# Altium project -CWT-check_thread.PrjPcb
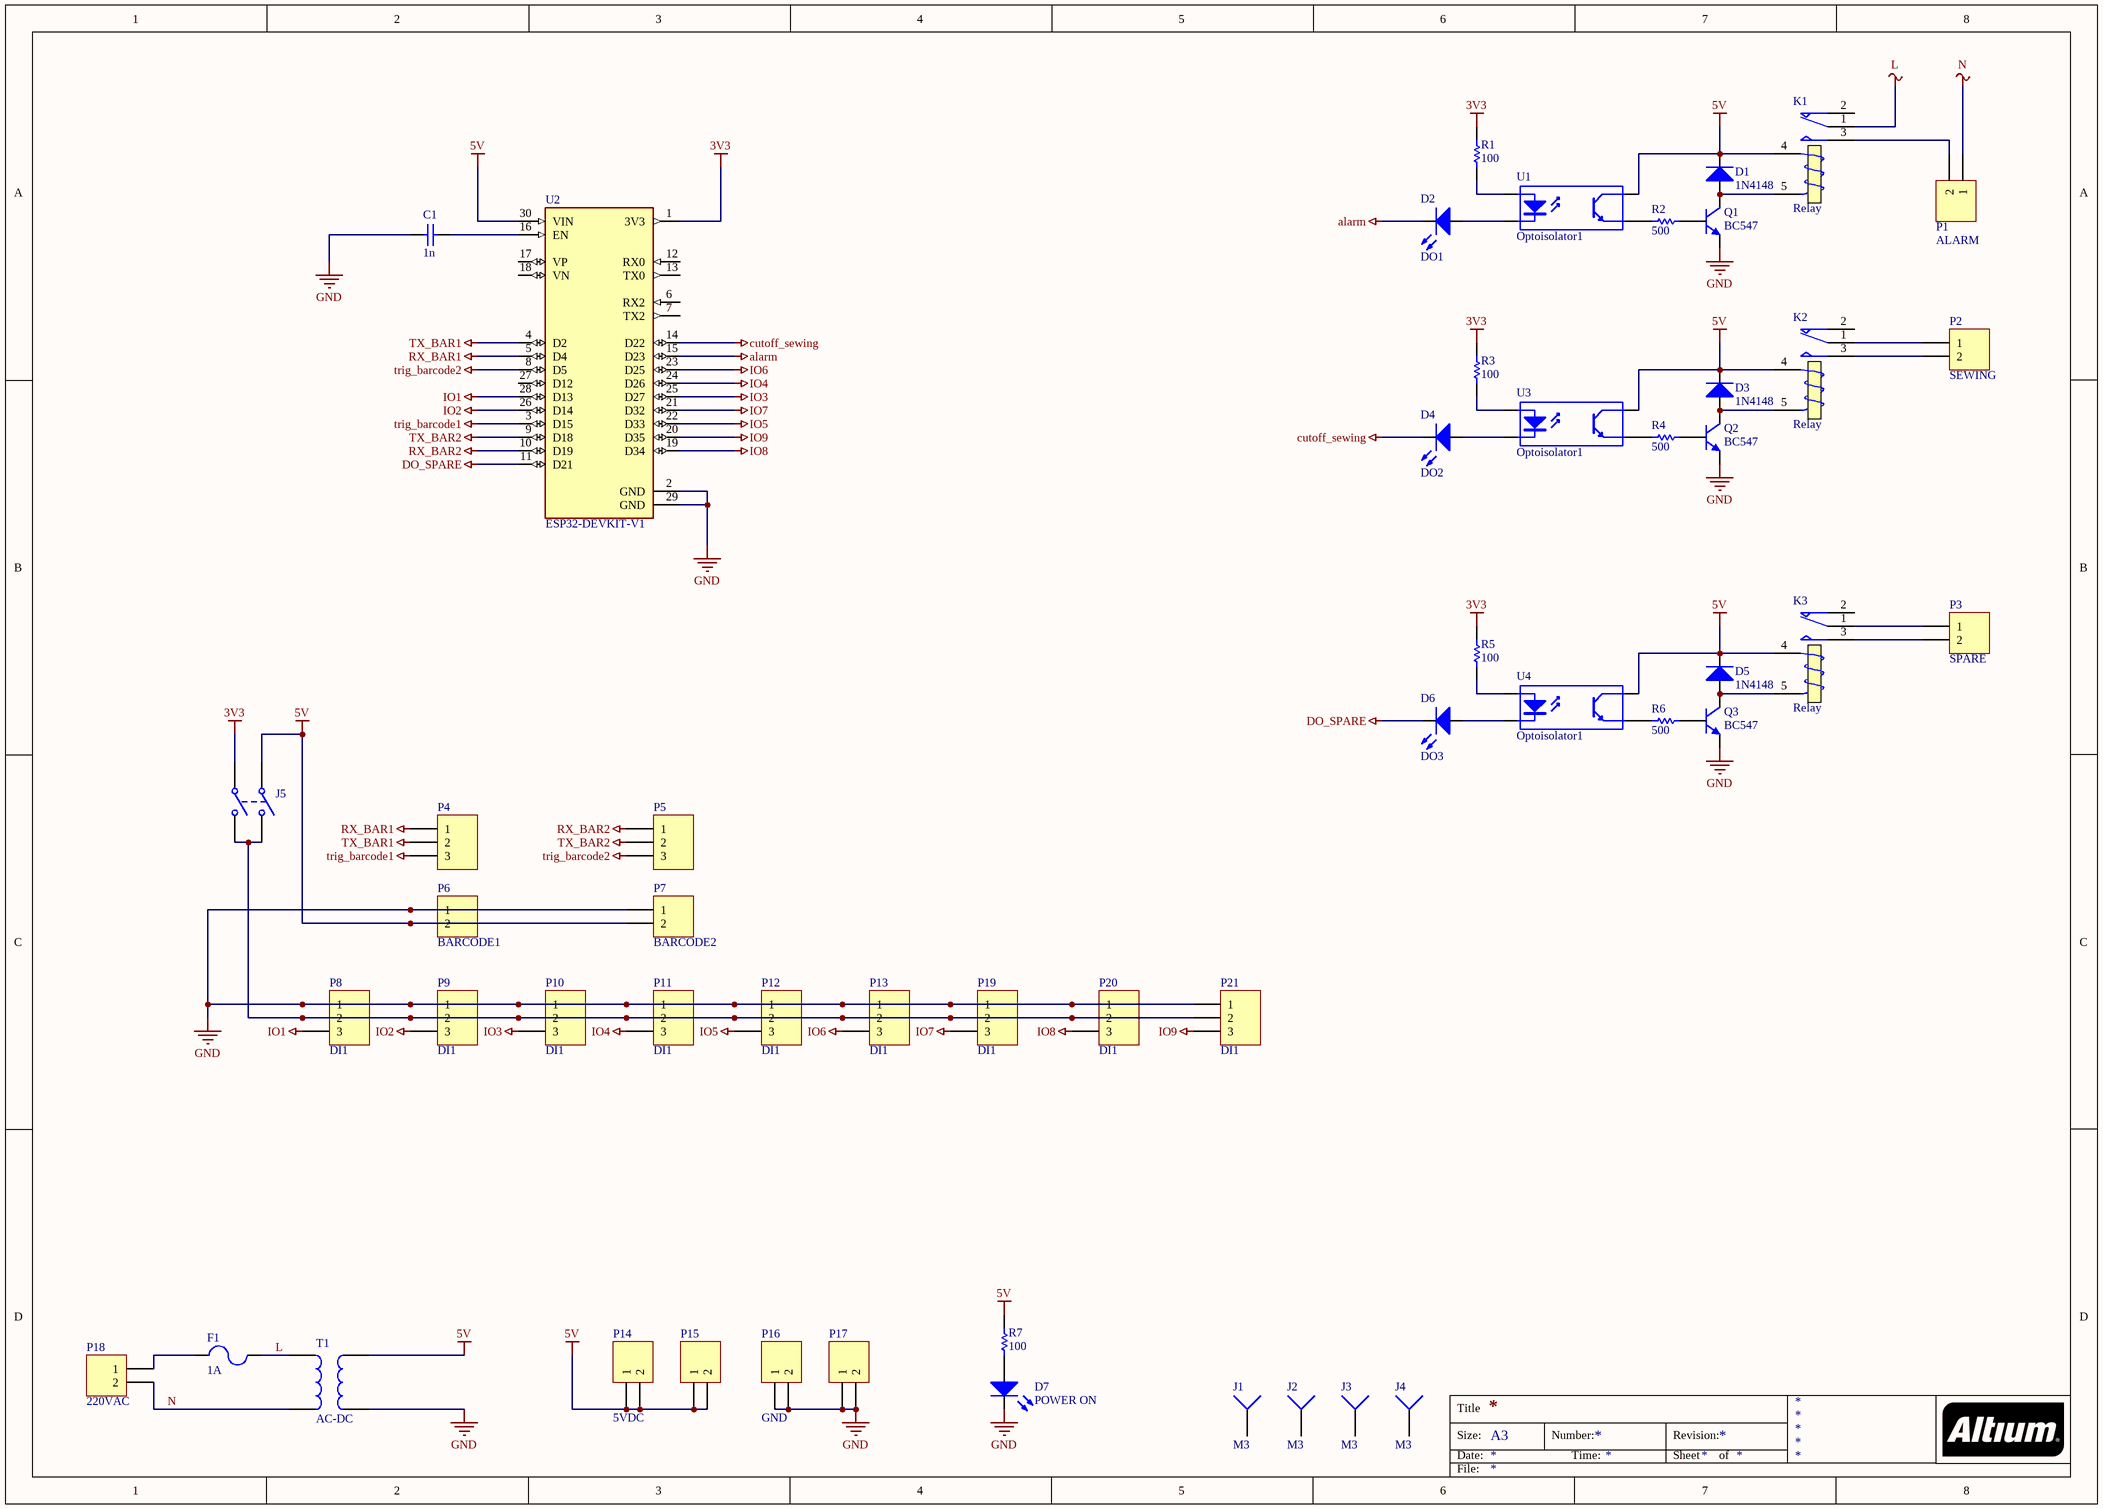
[diagram p0: sch.SchDoc]
1 sheet, 53 parts. Net scope: global (net labels, ports and power ports of the same name join across sheets).
Board file: PCB1.PcbDoc

## Sheet sch.SchDoc
size A3

### Parts
C1  1n  [CR2012-0805]
D1  1N4148  [D4148]
D2  DO1  [LED]
D3  1N4148  [D4148]
D4  DO2  [LED]
D5  1N4148  [D4148]
D6  DO3  [LED]
D7  POWER ON  [LED]
F1  1A  [CAP5W]
J1  M3  [PAD]
J2  M3  [PAD]
J3  M3  [PAD]
J4  M3  [PAD]
J5  (no value)  [sip2x2]
K1  Relay  [RELAY1CON_REV]
K2  Relay  [RELAY1CON_REV]
K3  Relay  [RELAY1CON_REV]
P1  ALARM  [KF142V-5.08-P2]
P2  SEWING  [KF142V-5.08-P2]
P3  SPARE  [KF142V-5.08-P2]
P4  (no value)  [CONNECT_W(3)]
P5  (no value)  [CONNECT_W(3)]
P6  BARCODE1  [CONNECT_2.54_(2)]
P7  BARCODE2  [CONNECT_2.54_(2)]
P8  DI1  [CONNECT_W(3)]
P9  DI1  [CONNECT_W(3)]
P10  DI1  [CONNECT_W(3)]
P11  DI1  [CONNECT_W(3)]
P12  DI1  [CONNECT_W(3)]
P13  DI1  [CONNECT_W(3)]
P14  5VDC  [KF142V-5.08-P2]
P15  (no value)  [KF142V-5.08-P2]
P16  GND  [KF142V-5.08-P2]
P17  (no value)  [KF142V-5.08-P2]
P18  220VAC  [KF142V-5.08-P2]
P19  DI1  [CONNECT_W(3)]
P20  DI1  [CONNECT_W(3)]
P21  DI1  [CONNECT_W(3)]
Q1  BC547  [TO-92]
Q2  BC547  [TO-92]
Q3  BC547  [TO-92]
R1  100  [R1/8]
R2  500  [R1/8]
R3  100  [R1/8]
R4  500  [R1/8]
R5  100  [R1/8]
R6  500  [R1/8]
R7  100  [R1/8]
T1  AC-DC  [HLK-PM01]
U1  Optoisolator1  [DIP-4 - TOP]
U2  ESP32-DEVKIT-V1  [ESP32_DEVKIT_V1]
U3  Optoisolator1  [DIP-4 - TOP]
U4  Optoisolator1  [DIP-4 - TOP]

### Nets
3V3: J5.3(COMMON2) R1.2 R3.2 R5.2 U2.1(3V3)
5V: D1.K D3.K D5.K J5.1(COMMON1) K1.4(T1) K2.4(T1) K3.4(T1) P6.2 P7.2 P14.1 P14.2 P15.1 P15.2 R7.1 T1.4 U1.4(C) U2.30(VIN) U3.4(C) U4.4(C)
alarm: D2.2(K) U2.15(D23)
cutoff_sewing: D4.2(K) U2.14(D22)
DO_SPARE: D6.2(K) U2.11(D21)
GND: C1.1 D7.2(K) P6.1 P7.1 P8.1 P9.1 P10.1 P11.1 P12.1 P13.1 P16.1 P16.2 P17.1 P17.2 P19.1 P20.1 P21.1 Q1.3(E) Q2.3(E) Q3.3(E) T1.3 U2.2(GND) U2.29(GND)
IO1: P8.3 U2.28(D13)
IO2: P9.3 U2.26(D14)
IO3: P10.3 U2.25(D27)
IO4: P11.3 U2.24(D26)
IO5: P12.3 U2.22(D33)
IO6: P13.3 U2.23(D25)
IO7: P19.3 U2.21(D32)
IO8: P20.3 U2.19(D34)
IO9: P21.3 U2.20(D35)
L: F1.2 K1.1(COM) T1.2
N: P1.1 P18.2 T1.1
RX_BAR1: P4.1 U2.5(D4)
RX_BAR2: P5.1 U2.10(D19)
trig_barcode1: P4.3 U2.3(D15)
trig_barcode2: P5.3 U2.8(D5)
TX_BAR1: P4.2 U2.4(D2)
TX_BAR2: P5.2 U2.9(D18)
NetC1_2: C1.2 U2.16(EN)
NetD1_A: D1.A K1.5(T2) Q1.1(C)
NetD2_1: D2.1(A) U1.2(K)
NetD3_A: D3.A K2.5(T2) Q2.1(C)
NetD4_1: D4.1(A) U3.2(K)
NetD5_A: D5.A K3.5(T2) Q3.1(C)
NetD6_1: D6.1(A) U4.2(K)
NetD7_1: D7.1(A) R7.2
NetF1_1: F1.1 P18.1
NetJ5_2: J5.2(NO1) J5.4(NO2) P8.2 P9.2 P10.2 P11.2 P12.2 P13.2 P19.2 P20.2 P21.2
NetK1_3: K1.3(NO) P1.2
NetK2_1: K2.1(COM) P2.1
NetK2_3: K2.3(NO) P2.2
NetK3_1: K3.1(COM) P3.1
NetK3_3: K3.3(NO) P3.2
NetQ1_2: Q1.2(B) R2.1
NetQ2_2: Q2.2(B) R4.1
NetQ3_2: Q3.2(B) R6.1
NetR1_1: R1.1 U1.1(A)
NetR2_2: R2.2 U1.3(E)
NetR3_1: R3.1 U3.1(A)
NetR4_2: R4.2 U3.3(E)
NetR5_1: R5.1 U4.1(A)
NetR6_2: R6.2 U4.3(E)

Not connected (* = marked no-connect by the designer): J1 1; J2 1; J3 1; J4 1; K1 2(NC); K2 2(NC); K3 2(NC); U2 6(RX2) 7(TX2) 12(RX0) 13(TX0) 17(VP) 18(VN) 27(D12)

### Notes on the sheet
- Title
- Size:
- Date:
- A3
- Number:
- Time:
- Revision:
- Sheet
- of
- File:

### Library data of the parts
C1 = Cap: Capacitor; Published: 8-Jun-2000; LatestRevisionDate: 17-Jul-2002; LatestRevisionNote: Re-released for DXP Platform.; PackageReference: RAD-0.3; Publisher: Altium Limited; PackageDescription: Radial Cap, Thru-Hole; 2 Leads; 0.3 in Pin Spacing; Value: 1n
D1 D3 D5 = Diode: Default Diode; Published: 8-Jun-2000; LatestRevisionDate: 17-Jul-2002; LatestRevisionNote: Re-released for DXP Platform.; PackageVersion: Sep-1996; PackageReference: SMC; Publisher: Altium Limited; PackageDescription: DO-214-AB/SMC; 2 C-Bend Leads; Body 7.9 x 5.9 mm, inc. leads (LxW); Code_JEDEC: DO-214-AB
D2 D4 D6 D7 = LED0: Typical INFRARED GaAs LED; Published: 8-Jun-2000; LatestRevisionDate: 08-Jul-2005; LatestRevisionNote: Mech Layer 1 removed.; PackageReference: LED-0; Publisher: Altium Limited; PackageDescription: LED; 2 Leads
F1 = Fuse 2: Fuse; Published: 8-Jun-2000; LatestRevisionDate: 17-Jul-2002; LatestRevisionNote: Re-released for DXP Platform.; PackageReference: PIN-W2/E2.8; Publisher: Altium Limited; PackageDescription: Thru-Hole; 2 Leads
J1-J4 = Socket: LatestRevisionDate: 17-Jul-2002; LatestRevisionNote: Re-released for DXP Platform.; Publisher: Altium Limited
J5 = SW-DPST: Double-Pole, Single-Throw Switch; Published: 24-Mar-1999; LatestRevisionDate: 17-Jul-2002; LatestRevisionNote: Re-released for DXP Platform.; PackageReference: DPST-4; Publisher: Altium Limited; PackageDescription: Switch; 4 Leads
K1-K3 = Relay: SPDT Relay; Published: 8-Jun-2000; LatestRevisionDate: 17-Jul-2002; LatestRevisionNote: Re-released for DXP Platform.; PackageReference: MODULE5B; Publisher: Altium Limited
P1-P3 P6 P7 P14-P18 = Header 2: Header, 2-Pin; LatestRevisionDate: 17-Jul-2002; LatestRevisionNote: Re-released for DXP Platform.; Publisher: Altium Limited
P4 P5 P8-P13 P19-P21 = Header 3: Header, 3-Pin; LatestRevisionDate: 17-Jul-2002; LatestRevisionNote: Re-released for DXP Platform.; Publisher: Altium Limited
Q1-Q3 = 2N3904: NPN General Purpose Amplifier; Published: 8-Jun-2000; LatestRevisionDate: 15-Jan-2003; LatestRevisionNote: PCB Footprint 'BCY-W3/D4.7' replaced; DatasheetVersion: 1997; PackageVersion: Sep-1998; PackageReference: TO-92A; Publisher: Altium Limited; PackageDescription: TO, Flat Index; 3 In-Line, Axial Leads; Body Dia. 4.5mm; Leads 0.51 x 0.48 mm (max); ComponentLink1Description: Manufacturer Link; ComponentLink1URL: http://www.fairchildsemi.com/; ComponentLink2Description: Datasheet; ComponentLink2URL: http://www.fairchildsemi.com/ds/2N%2F2N3904.pdf
R1-R7 = Res1: Resistor; Value: 1K; Published: 8-Jun-2000; LatestRevisionDate: 17-Jul-2002; LatestRevisionNote: Re-released for DXP Platform.; PackageReference: AXIAL-0.3; Publisher: Altium Limited; PackageDescription: Axial Device, Thru-Hole; 2 Leads; 0.3 in Pin Spacing
T1 = Trans: Transformer; Published: 24-Mar-1999; LatestRevisionDate: 08-Jul-2005; LatestRevisionNote: Mech Layer 1 removed.; PackageReference: TRANS; Publisher: Altium Limited; PackageDescription: Transformer; 4 Leads
U1 U3 U4 = Optoisolator1: 4-Pin Phototransistor Optocoupler; Published: 24-Mar-1999; LatestRevisionDate: 04-Mar-2005; LatestRevisionNote: Sch pins 3 & 4 Swapped.; DatasheetVersion: Nov-2003; PackageReference: DIP-4; Publisher: Altium Limited
U2 = ESP32-DEVKIT-V1: Dual core, Wi-Fi: 2.4 GHz up to 150 Mbits/s,BLE (Bluetooth Low Energy) and legacy Bluetooth, 32 bits, Up to 240 MHz